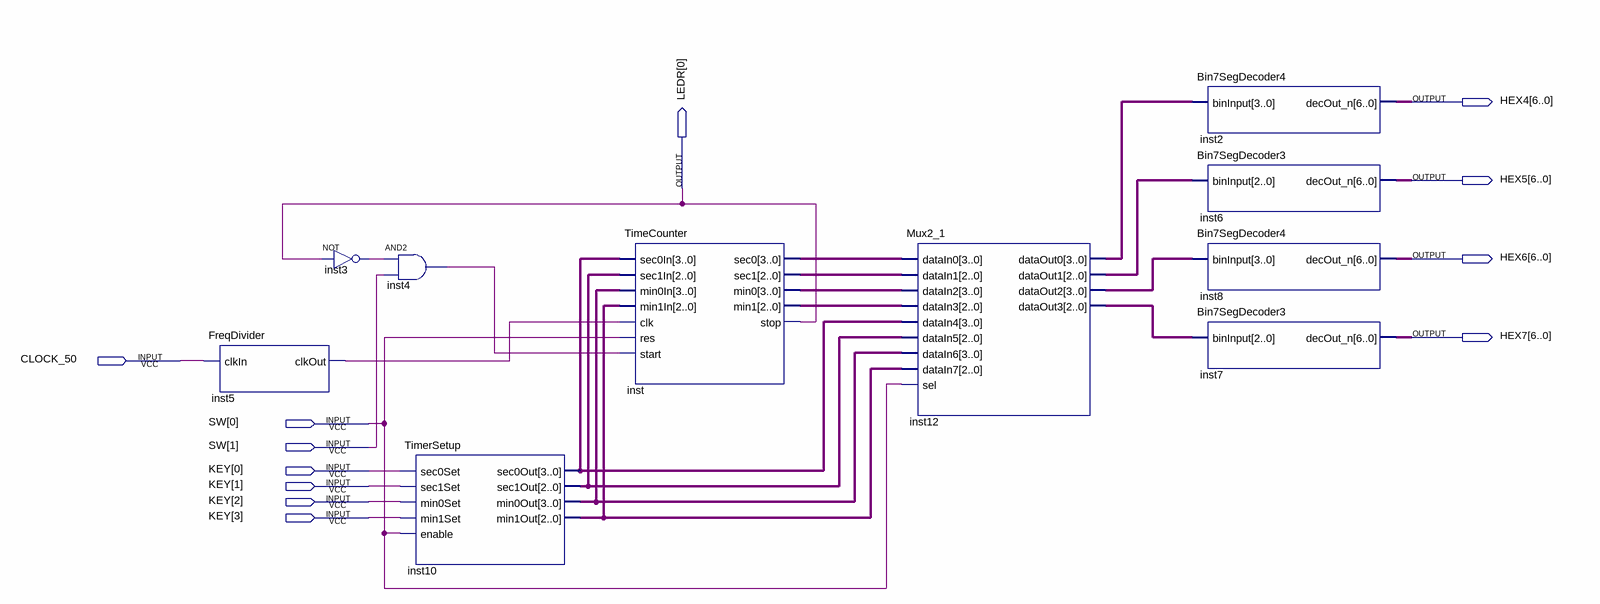
[diagram p0: schematic sheet]
// Quartus schematic Fase3.bdf as structural Verilog: 10 symbols, 12 pins
module Fase3 (
  input  CLOCK_50,
  input  [1:0] SW,
  input  [3:0] KEY,
  output [6:0] HEX4,
  output [6:0] HEX5,
  output [0:0] LEDR,
  output [6:0] HEX6,
  output [6:0] HEX7
);

  wire inst3_out, inst4_out, inst5_clkout;
  wire [2:0] inst10_min1out, inst10_sec1out, inst12_dataout1, inst12_dataout3, inst_min1, inst_sec1;
  wire [3:0] inst10_min0out, inst10_sec0out, inst12_dataout0, inst12_dataout2, inst_min0, inst_sec0;

  FreqDivider inst5 (.clkIn(CLOCK_50), .clkOut(inst5_clkout));
  not inst3 (inst3_out, LEDR[0]);
  and inst4 (inst4_out, inst3_out, SW[1]);
  TimerSetup inst10 (
    .sec0Set(KEY[0]), .sec1Set(KEY[1]), .min0Set(KEY[2]), .min1Set(KEY[3]), .enable(SW[0]),
    .sec0Out(inst10_sec0out), .sec1Out(inst10_sec1out), .min0Out(inst10_min0out), .min1Out(inst10_min1out));
  TimeCounter inst (
    .sec0In(inst10_sec0out), .sec1In(inst10_sec1out), .min0In(inst10_min0out), .min1In(inst10_min1out),
    .clk(inst5_clkout), .res(SW[0]), .start(inst4_out), .sec0(inst_sec0), .sec1(inst_sec1), .min0(inst_min0),
    .min1(inst_min1), .stop(LEDR[0]));
  Mux2_1 inst12 (
    .dataIn0(inst_sec0), .dataIn1(inst_sec1), .dataIn2(inst_min0), .dataIn3(inst_min1),
    .dataIn4(inst10_sec0out), .dataIn5(inst10_sec1out), .dataIn6(inst10_min0out), .dataIn7(inst10_min1out),
    .sel(SW[0]), .dataOut0(inst12_dataout0), .dataOut1(inst12_dataout1), .dataOut2(inst12_dataout2),
    .dataOut3(inst12_dataout3));
  Bin7SegDecoder4 inst2 (.binInput(inst12_dataout0), .decOut_n(HEX4));
  Bin7SegDecoder3 inst6 (.binInput(inst12_dataout1), .decOut_n(HEX5));
  Bin7SegDecoder4 inst8 (.binInput(inst12_dataout2), .decOut_n(HEX6));
  Bin7SegDecoder3 inst7 (.binInput(inst12_dataout3), .decOut_n(HEX7));
endmodule
